# EAGLE schematic 1 (EAGLE 6.4)
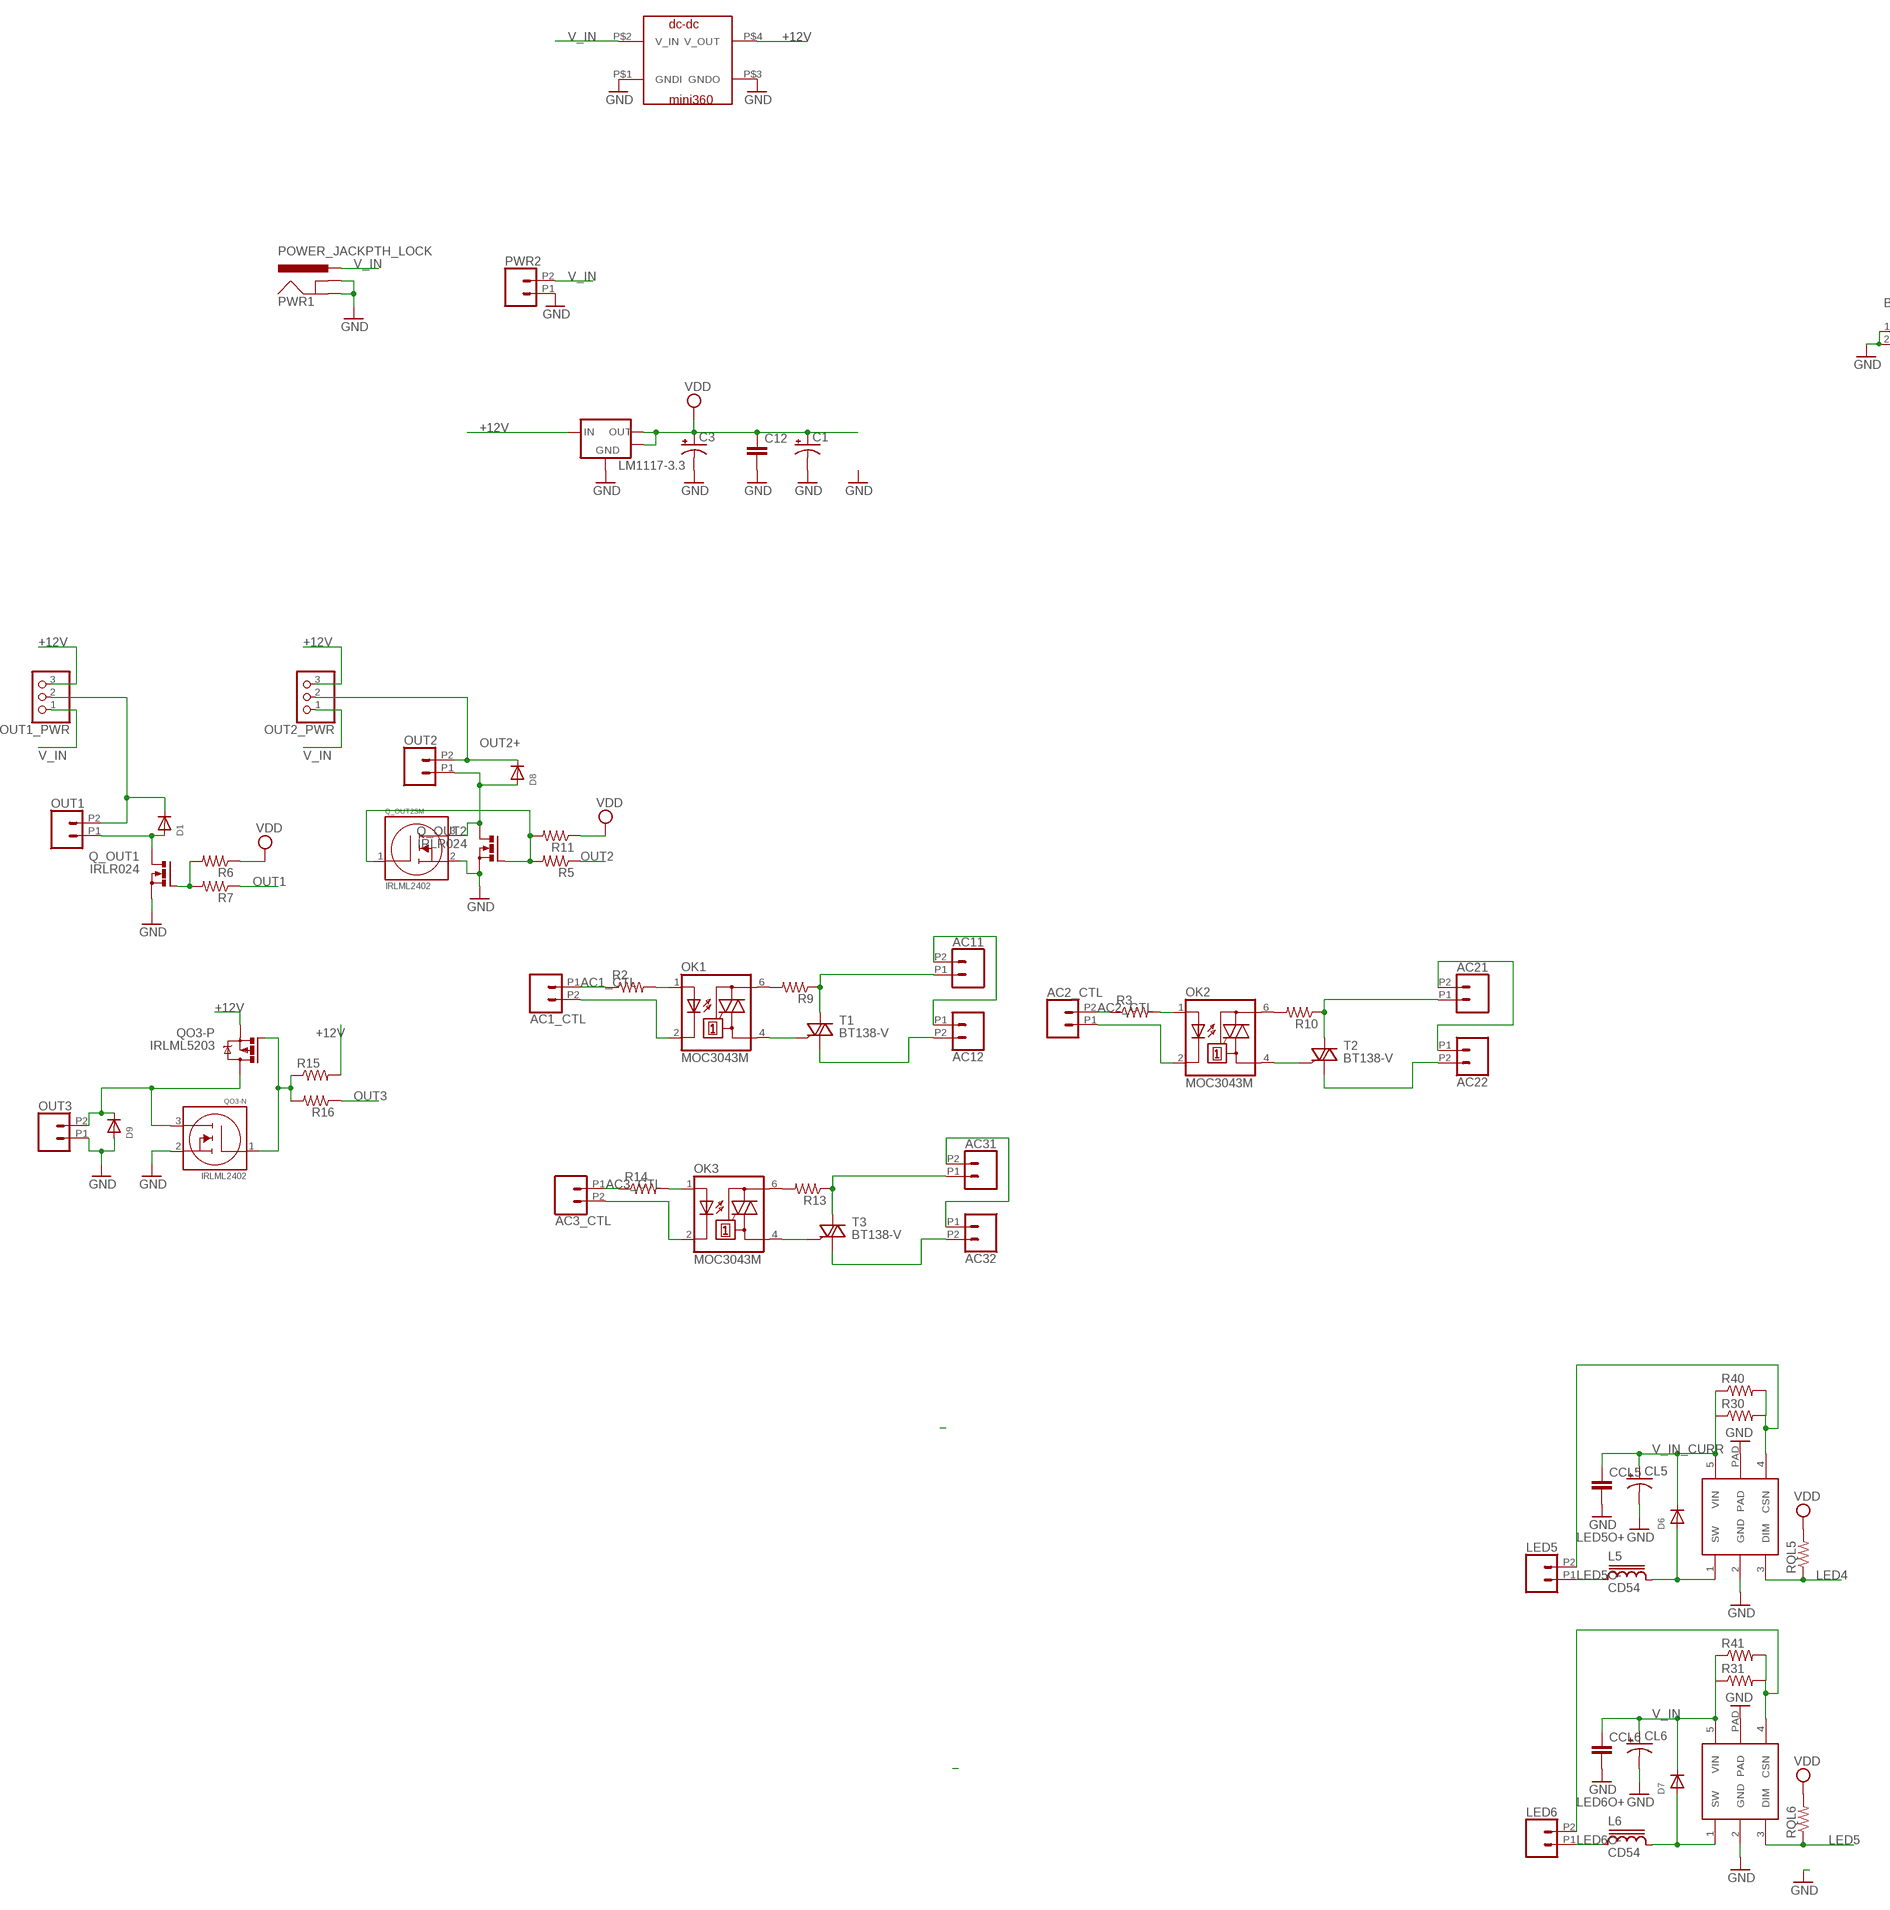
[diagram p0: schematic, sheet 1, part 1 of 3]
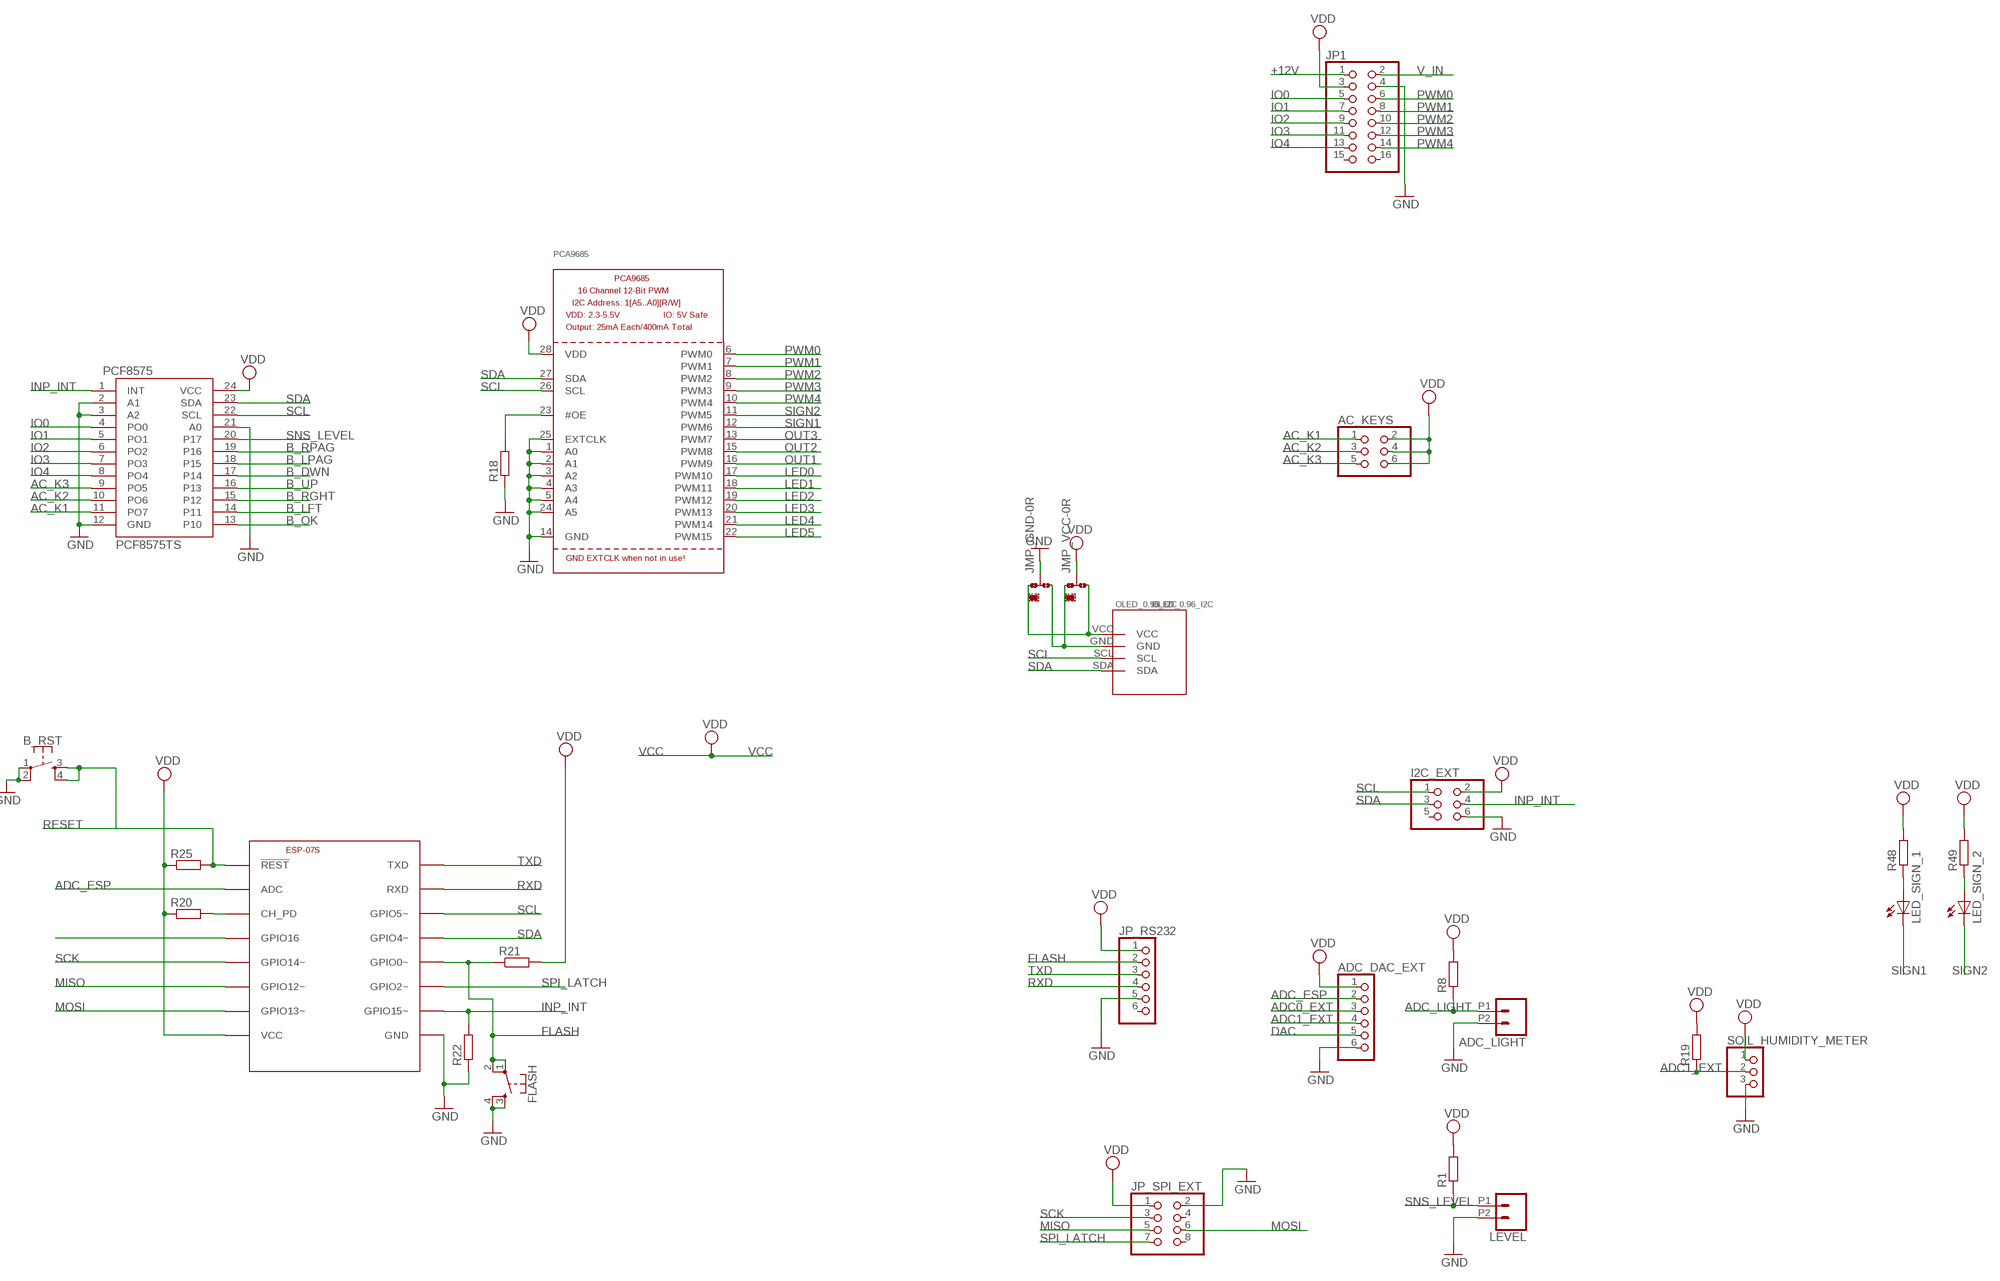
[diagram p1: schematic, sheet 1, part 2 of 3]
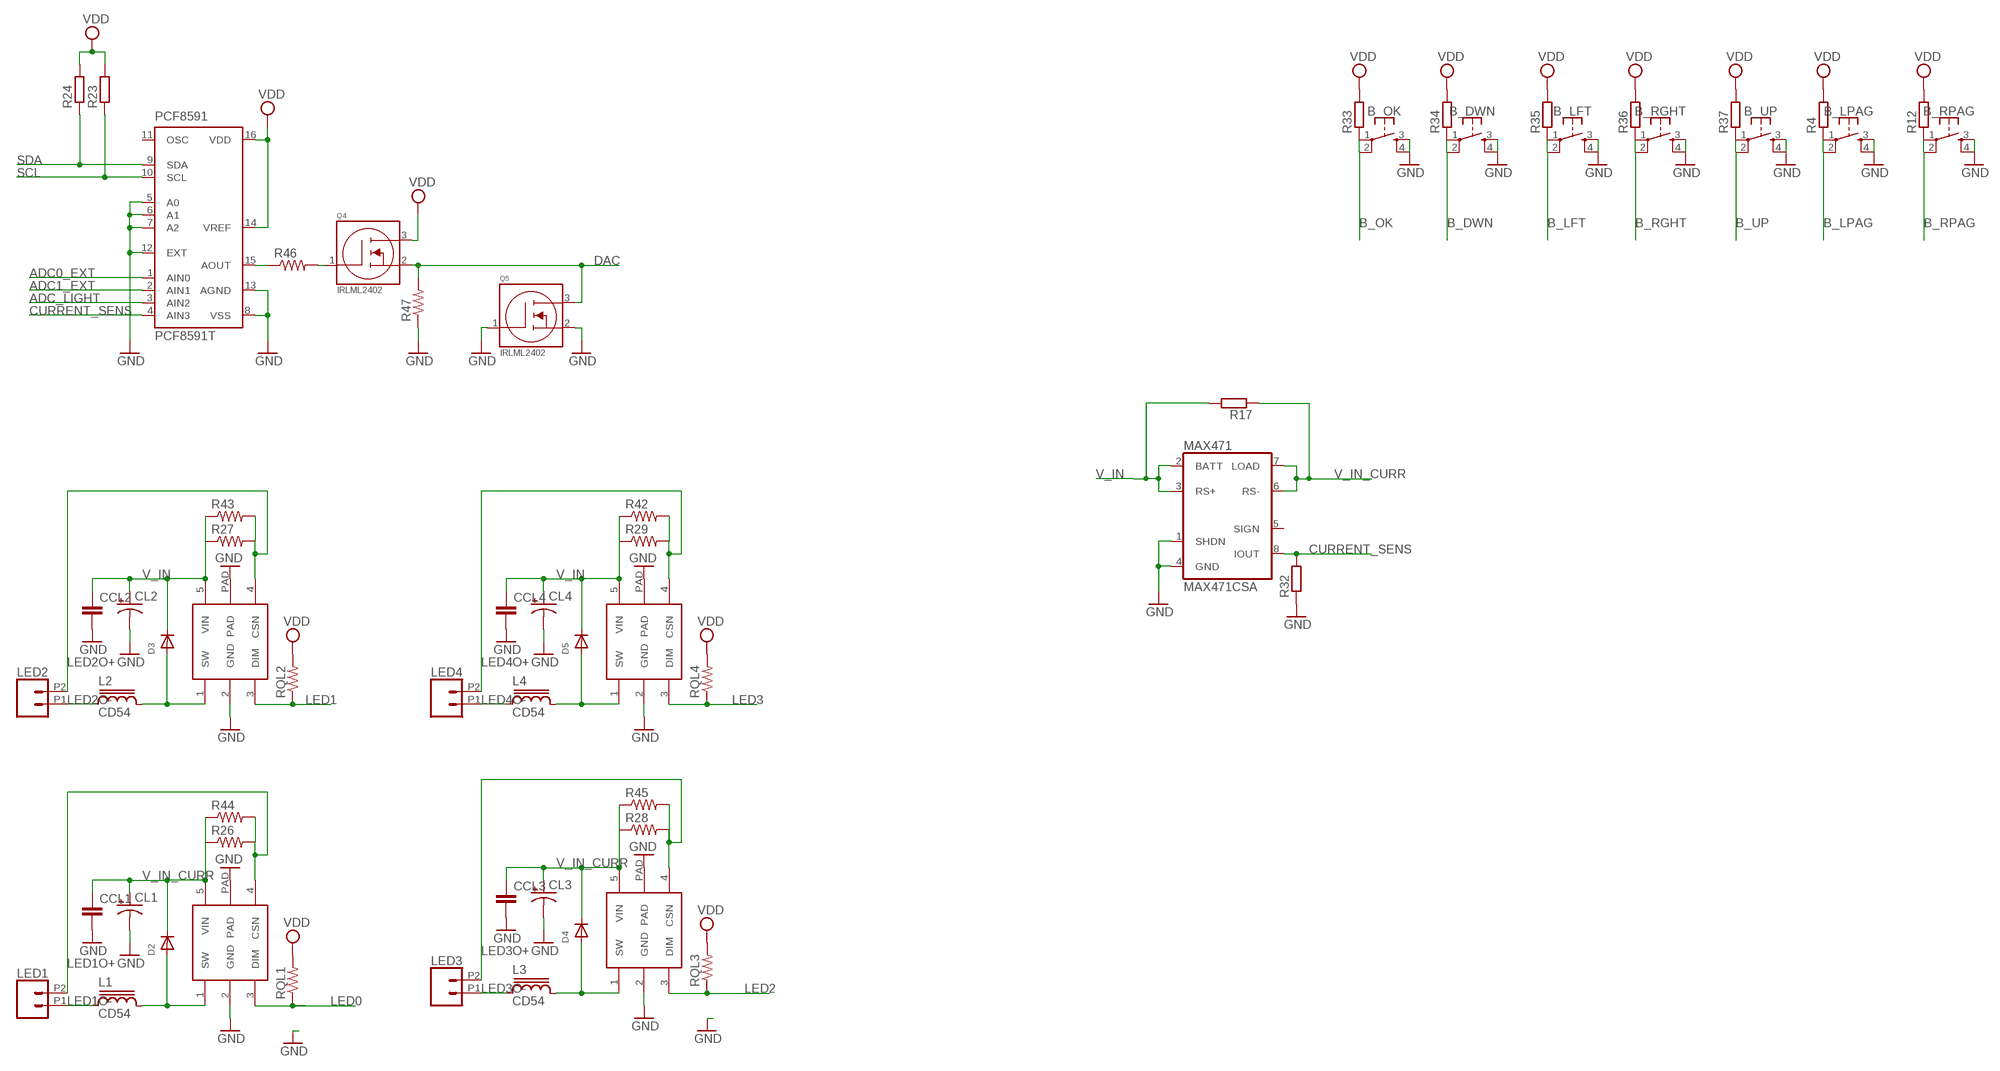
[diagram p2: schematic, sheet 1, part 3 of 3]

## Parts
AC1_CTL  CONN_022.54MM_SCREWTERM  [1X02_2.54_SCREWTERM]
AC2_CTL  CONN_022.54MM_SCREWTERM  [1X02_2.54_SCREWTERM]
AC3_CTL  CONN_022.54MM_SCREWTERM  [1X02_2.54_SCREWTERM]
AC11  CONN_022.54MM_SCREWTERM  [1X02_2.54_SCREWTERM]
AC12  CONN_022.54MM_SCREWTERM  [1X02_2.54_SCREWTERM]
AC21  CONN_022.54MM_SCREWTERM  [1X02_2.54_SCREWTERM]
AC22  CONN_022.54MM_SCREWTERM  [1X02_2.54_SCREWTERM]
AC31  CONN_022.54MM_SCREWTERM  [1X02_2.54_SCREWTERM]
AC32  CONN_022.54MM_SCREWTERM  [1X02_2.54_SCREWTERM]
AC_KEYS  PINHD-2X3  [2X03]
ADC_DAC_EXT  PINHD-1X6  [1X06]
ADC_LIGHT  CONN_022.54MM_SCREWTERM  [1X02_2.54_SCREWTERM]
B_DWN  MOMENTARY-SWITCH-SPST-2-SMD-5.2MM  [TACTILE_SWITCH_SMD_5.2MM]
B_LFT  MOMENTARY-SWITCH-SPST-2-SMD-5.2MM  [TACTILE_SWITCH_SMD_5.2MM]
B_LPAG  MOMENTARY-SWITCH-SPST-2-SMD-5.2MM  [TACTILE_SWITCH_SMD_5.2MM]
B_OK  MOMENTARY-SWITCH-SPST-2-SMD-5.2MM  [TACTILE_SWITCH_SMD_5.2MM]
B_RGHT  MOMENTARY-SWITCH-SPST-2-SMD-5.2MM  [TACTILE_SWITCH_SMD_5.2MM]
B_RPAG  MOMENTARY-SWITCH-SPST-2-SMD-5.2MM  [TACTILE_SWITCH_SMD_5.2MM]
B_RST  MOMENTARY-SWITCH-SPST-2-SMD-5.2MM  [TACTILE_SWITCH_SMD_5.2MM]
B_UP  MOMENTARY-SWITCH-SPST-2-SMD-5.2MM  [TACTILE_SWITCH_SMD_5.2MM]
C1  CPOL-US153CLV-0505  [153CLV-0505]
C3  CPOL-US153CLV-0505  [153CLV-0505]
C12  C-EUC0805  [C0805]
CCL1  C-EUC0805K  [C0805K]
CCL2  C-EUC0805K  [C0805K]
CCL3  C-EUC0805K  [C0805K]
CCL4  C-EUC0805K  [C0805K]
CCL5  C-EUC0805K  [C0805K]
CCL6  C-EUC0805K  [C0805K]
CL1  CPOL-US153CLV-0605  [153CLV-0605]
CL2  CPOL-US153CLV-0605  [153CLV-0605]
CL3  CPOL-US153CLV-0605  [153CLV-0605]
CL4  CPOL-US153CLV-0605  [153CLV-0605]
CL5  CPOL-US153CLV-0605  [153CLV-0605]
CL6  CPOL-US153CLV-0605  [153CLV-0605]
D1  DIODESMA  [SMADIODE]
D2  DIODESMA  [SMADIODE]
D3  DIODESMA  [SMADIODE]
D4  DIODESMA  [SMADIODE]
D5  DIODESMA  [SMADIODE]
D6  DIODESMA  [SMADIODE]
D7  DIODESMA  [SMADIODE]
D8  DIODESMA  [SMADIODE]
D9  DIODESMA  [SMADIODE]
ESP-07S  ESP8266-08  [ESP-08]
FLASH  MOMENTARY-SWITCH-SPST-2-SMD-5.2MM  [TACTILE_SWITCH_SMD_5.2MM]
I2C_EXT  PINHD-2X3  [2X03]
JMP_GND  0R-JUMPA  [A0R-JMP]
JMP_VCC  0R-JUMPA  [A0R-JMP]
JP1  PINHD-2X8  [2X08]
JP_RS232  PINHD-1X6  [1X06]
JP_SPI_EXT  PINHD-2X4  [2X04]
L1  CD54  [CD54]
L2  CD54  [CD54]
L3  CD54  [CD54]
L4  CD54  [CD54]
L5  CD54  [CD54]
L6  CD54  [CD54]
LED1  CONN_022.54MM_SCREWTERM  [1X02_2.54_SCREWTERM]
LED2  CONN_022.54MM_SCREWTERM  [1X02_2.54_SCREWTERM]
LED3  CONN_022.54MM_SCREWTERM  [1X02_2.54_SCREWTERM]
LED4  CONN_022.54MM_SCREWTERM  [1X02_2.54_SCREWTERM]
LED5  CONN_022.54MM_SCREWTERM  [1X02_2.54_SCREWTERM]
LED6  CONN_022.54MM_SCREWTERM  [1X02_2.54_SCREWTERM]
LED_SIGN_1  LEDCHIP-LED0805  [CHIP-LED0805]
LED_SIGN_2  LEDCHIP-LED0805  [CHIP-LED0805]
LEVEL  CONN_022.54MM_SCREWTERM  [1X02_2.54_SCREWTERM]
LM1117-3.3  LM1117-3.3  [SOT223]
MAX471  MAX471CSA  [SO08]
OK1  MOC3043M  [DIL06]
OK2  MOC3043M  [DIL06]
OK3  MOC3043M  [DIL06]
OLED_0.96_I2C  OLED_0.96_I2C  [OLED_0.96_I2C]
OUT1  CONN_022.54MM_SCREWTERM  [1X02_2.54_SCREWTERM]
OUT1_PWR  PINHD-1X3  [1X03]
OUT2  CONN_022.54MM_SCREWTERM  [1X02_2.54_SCREWTERM]
OUT2_PWR  PINHD-1X3  [1X03]
OUT3  CONN_022.54MM_SCREWTERM  [1X02_2.54_SCREWTERM]
PCA9685  PCA9685  [TSSOP28]
PCF8575  PCF8575TS  [SSOP24]
PCF8591  PCF8591T  [SO16W]
PWR1  POWER_JACKPTH_LOCK  [POWER_JACK_PTH_LOCK]
PWR2  CONN_022.54MM_SCREWTERM  [1X02_2.54_SCREWTERM]
Q4  IRLML2402  [SOT23]
Q5  IRLML2402  [SOT23]
Q_OUT1  IRLR024  [D-PAK_TO252AA]
Q_OUT2  IRLR024  [D-PAK_TO252AA]
Q_OUT2SM  IRLML2402  [SOT23]
QO3-N  IRLML2402  [SOT23]
QO3-P  IRLML5203  [MICRO3]
R1  R-EU_M0805  [M0805]
R2  RESISTOR0805-RES  [0805]
R3  RESISTOR0805-RES  [0805]
R4  R-EU_M0805  [M0805]
R5  RESISTOR0805-RES  [0805]
R6  RESISTOR0805-RES  [0805]
R7  RESISTOR0805-RES  [0805]
R8  R-EU_M0805  [M0805]
R9  RESISTOR0805-RES  [0805]
R10  RESISTOR0805-RES  [0805]
R11  RESISTOR0805-RES  [0805]
R12  R-EU_M0805  [M0805]
R13  RESISTOR0805-RES  [0805]
R14  RESISTOR0805-RES  [0805]
R15  RESISTOR0805-RES  [0805]
R16  RESISTOR0805-RES  [0805]
R17  R-EU_M0805  [M0805]
R18  R-EU_M0805  [M0805]
R19  R-EU_M0805  [M0805]
R20  R-EU_M0805  [M0805]
R21  R-EU_M0805  [M0805]
R22  R-EU_M0805  [M0805]
R23  R-EU_M0805  [M0805]
R24  R-EU_M0805  [M0805]
R25  R-EU_M0805  [M0805]
R26  RESISTOR  [0805]
R27  RESISTOR  [0805]
R28  RESISTOR  [0805]
R29  RESISTOR  [0805]
R30  RESISTOR  [0805]
R31  RESISTOR  [0805]
R32  R-EU_M0805  [M0805]
R33  R-EU_M0805  [M0805]
R34  R-EU_M0805  [M0805]
R35  R-EU_M0805  [M0805]
R36  R-EU_M0805  [M0805]
R37  R-EU_M0805  [M0805]
R40  RESISTOR  [0805]
R41  RESISTOR  [0805]
R42  RESISTOR  [0805]
R43  RESISTOR  [0805]
R44  RESISTOR  [0805]
R45  RESISTOR  [0805]
R46  RESISTOR  [0805]
R47  RESISTOR  [0805]
R48  R-EU_M0805  [M0805]
R49  R-EU_M0805  [M0805]
RQL1  RESISTOR  [0805]
RQL2  RESISTOR  [0805]
RQL3  RESISTOR  [0805]
RQL4  RESISTOR  [0805]
RQL5  RESISTOR  [0805]
RQL6  RESISTOR  [0805]
SOIL_HUMIDITY_METER  PINHD-1X3  [1X03]
T1  BT138-V  [TO220BV]
T2  BT138-V  [TO220BV]
T3  BT138-V  [TO220BV]
U$6  PT4115  [SOT89-5]
U$7  PT4115  [SOT89-5]
U$8  PT4115  [SOT89-5]
U$9  PT4115  [SOT89-5]
U$10  PT4115  [SOT89-5]
U$12  MINI360  [MINI360]
U$13  PT4115  [SOT89-5]

## Nets
+12V: JP1.1 LM1117-3.3.3(IN) OUT1_PWR.3 OUT2_PWR.3 QO3-P.2(S) R15.2 U$12.P$4(V_OUT)
AC1_CTL: AC1_CTL.P1 R2.1
AC2_CTL: AC2_CTL.P2 R3.1
AC3_CTL: AC3_CTL.P1 R14.1
AC11: AC11.P1 R9.1 T1.T2(A2)
AC12: AC12.P2 T1.T1(A1)
AC13: AC11.P2 AC12.P1
AC21: AC21.P1 R10.1 T2.T2(A2)
AC22: AC22.P2 T2.T1(A1)
AC23: AC21.P2 AC22.P1
AC31: AC31.P1 R13.1 T3.T2(A2)
AC32: AC32.P2 T3.T1(A1)
AC33: AC31.P2 AC32.P1
AC_K1: AC_KEYS.1 PCF8575.11(PO7)
AC_K2: AC_KEYS.3 PCF8575.10(PO6)
AC_K3: AC_KEYS.5 PCF8575.9(PO5)
ADC0_EXT: ADC_DAC_EXT.3 PCF8591.1(AIN0)
ADC1_EXT: ADC_DAC_EXT.4 PCF8591.2(AIN1) R19.1 SOIL_HUMIDITY_METER.2
ADC_ESP: ADC_DAC_EXT.2 ESP-07S.ADC
ADC_LIGHT: ADC_LIGHT.P1 PCF8591.3(AIN2) R8.1
B_DWN: B_DWN.1 B_DWN.2 PCF8575.17(P14) R34.1
B_LFT: B_LFT.1 B_LFT.2 PCF8575.14(P11) R35.1
B_LPAG: B_LPAG.1 B_LPAG.2 PCF8575.18(P15) R4.1
B_OK: B_OK.1 B_OK.2 PCF8575.13(P10) R33.1
B_RGHT: B_RGHT.1 B_RGHT.2 PCF8575.15(P12) R36.1
B_RPAG: B_RPAG.1 B_RPAG.2 PCF8575.19(P16) R12.1
B_UP: B_UP.1 B_UP.2 PCF8575.16(P13) R37.1
CURRENT_SENS: MAX471.8(IOUT) PCF8591.4(AIN3) R32.2
DAC: ADC_DAC_EXT.5 Q4.2(SOURCE) Q5.3(DRAIN) R47.2
FLASH: ESP-07S.GPIO0(GPIO0~) FLASH.1 FLASH.2 JP_RS232.2 R21.1
GND: ADC_DAC_EXT.6 ADC_LIGHT.P2 B_DWN.3 B_DWN.4 B_LFT.3 B_LFT.4 B_LPAG.3 B_LPAG.4 B_OK.3 B_OK.4 B_RGHT.3 B_RGHT.4 B_RPAG.3 B_RPAG.4 B_RST.1 B_RST.2 B_UP.3 B_UP.4 C1.- C3.- C12.2 CCL1.2 CCL2.2 CCL3.2 CCL4.2 CCL5.2 CCL6.2 CL1.- CL2.- CL3.- CL4.- CL5.- CL6.- D9.A ESP-07S.GND FLASH.3 FLASH.4 I2C_EXT.6 JMP_GND.2 JP1.4 JP_RS232.5 JP_SPI_EXT.2 LEVEL.P2 LM1117-3.3.1(GND) MAX471.1(SHDN) MAX471.4(GND) OUT3.P1 PCA9685.1(A0) PCA9685.2(A1) PCA9685.3(A2) PCA9685.4(A3) PCA9685.5(A4) PCA9685.14(GND) PCA9685.24(A5) PCA9685.25(EXTCLK) PCF8575.2(A1) PCF8575.3(A2) PCF8575.12(GND) PCF8575.21(A0) PCF8591.5(A0) PCF8591.6(A1) PCF8591.7(A2) PCF8591.8(VSS) PCF8591.12(EXT) PCF8591.13(AGND) PWR1.GND PWR1.GNDBREAK PWR2.P1 Q5.1(GATE) Q5.2(SOURCE) Q_OUT1.3(SOURCE) Q_OUT2.3(SOURCE) Q_OUT2SM.2(SOURCE) QO3-N.2(SOURCE) R18.1 R22.1 R32.1 R47.1 SOIL_HUMIDITY_METER.3 U$6.2(GND) U$6.PAD U$7.2(GND) U$7.PAD U$8.2(GND) U$8.PAD U$9.2(GND) U$9.PAD U$10.2(GND) U$10.PAD U$12.P$1(GNDI) U$12.P$3(GNDO) U$13.2(GND) U$13.PAD
INP_INT: ESP-07S.GPIO15(GPIO15~) I2C_EXT.4 PCF8575.1(INT) R22.2
IO0: JP1.5 PCF8575.4(PO0)
IO1: JP1.7 PCF8575.5(PO1)
IO2: JP1.9 PCF8575.6(PO2)
IO3: JP1.11 PCF8575.7(PO3)
IO4: JP1.13 PCF8575.8(PO4)
LED0: PCA9685.17(PWM10) RQL1.1 U$13.3(DIM)
LED1: PCA9685.18(PWM11) RQL2.1 U$6.3(DIM)
LED1_SW: D2.A L1.2 U$13.1(SW)
LED1O+: LED1.P2 R26.2 R44.2 U$13.4(CSN)
LED1O-: L1.1 LED1.P1
LED2: PCA9685.19(PWM12) RQL3.1 U$7.3(DIM)
LED2_SW: D3.A L2.2 U$6.1(SW)
LED2O+: LED2.P2 R27.2 R43.2 U$6.4(CSN)
LED2O-: L2.1 LED2.P1
LED3: PCA9685.20(PWM13) RQL4.1 U$8.3(DIM)
LED3_SW: D4.A L3.2 U$7.1(SW)
LED3O+: LED3.P2 R28.2 R45.2 U$7.4(CSN)
LED3O-: L3.1 LED3.P1
LED4: PCA9685.21(PWM14) RQL5.1 U$9.3(DIM)
LED4_SW: D5.A L4.2 U$8.1(SW)
LED4O+: LED4.P2 R29.2 R42.2 U$8.4(CSN)
LED4O-: L4.1 LED4.P1
LED5: PCA9685.22(PWM15) RQL6.1 U$10.3(DIM)
LED5_SW: D6.A L5.2 U$9.1(SW)
LED5O+: LED5.P2 R30.2 R40.2 U$9.4(CSN)
LED5O-: L5.1 LED5.P1
LED6_SW: D7.A L6.2 U$10.1(SW)
LED6O+: LED6.P2 R31.2 R41.2 U$10.4(CSN)
LED6O-: L6.1 LED6.P1
MISO: ESP-07S.GPIO12(GPIO12~) JP_SPI_EXT.5
MOSI: ESP-07S.GPIO13(GPIO13~) JP_SPI_EXT.6
N$1: JMP_GND.1 JMP_VCC.3 OLED_0.96_I2C.VCC
N$3: JMP_GND.3 JMP_VCC.1 OLED_0.96_I2C.GND
N$4: LED_SIGN_1.A R48.1
N$5: LED_SIGN_2.A R49.1
N$6: AC1_CTL.P2 OK1.2(C)
N$8: PCA9685.23(#OE) R18.2
N$9: Q_OUT2.1(GATE) Q_OUT2SM.1(GATE) R5.2 R11.2
N$11: Q_OUT1.1(GATE) R6.2 R7.2
N$13: QO3-N.1(GATE) QO3-P.1(G) R15.1 R16.2
N$16: AC3_CTL.P2 OK3.2(C)
N$18: OK1.1(A) R2.2
N$19: OK1.4(A1) T1.G
N$20: ESP-07S.CH_PD R20.2
N$24: OK1.6(A2) R9.2
N$28: OK2.4(A1) T2.G
N$31: OK2.6(A2) R10.2
N$32: OK2.1(A) R3.2
N$34: OK3.4(A1) T3.G
N$35: OK3.6(A2) R13.2
N$36: PCF8591.15(AOUT) R46.1
N$37: ESP-07S.GPIO16
N$42: Q4.1(GATE) R46.2
N$45: AC2_CTL.P1 OK2.2(C)
N$47: OK3.1(A) R14.2
OUT1: PCA9685.16(PWM9) R7.1
OUT1+: D1.C OUT1.P2 OUT1_PWR.2
OUT1-: D1.A OUT1.P1 Q_OUT1.2(DRAIN)
OUT2: PCA9685.15(PWM8) R5.1
OUT2+: D8.C OUT2.P2 OUT2_PWR.2
OUT2-: D8.A OUT2.P1 Q_OUT2.2(DRAIN) Q_OUT2SM.3(DRAIN)
OUT3: PCA9685.13(PWM7) R16.1
OUT3+: D9.C OUT3.P2 QO3-N.3(DRAIN) QO3-P.3(D)
PWM0: JP1.6 PCA9685.6(PWM0)
PWM1: JP1.8 PCA9685.7(PWM1)
PWM2: JP1.10 PCA9685.8(PWM2)
PWM3: JP1.12 PCA9685.9(PWM3)
PWM4: JP1.14 PCA9685.10(PWM4)
RESET: B_RST.3 B_RST.4 ESP-07S.REST(!REST) R25.2
RXD: ESP-07S.RXD JP_RS232.4
SCK: ESP-07S.GPIO14(GPIO14~) JP_SPI_EXT.3
SCL: ESP-07S.GPIO4(GPIO5~) I2C_EXT.1 OLED_0.96_I2C.SCL PCA9685.26(SCL) PCF8575.22(SCL) PCF8591.10(SCL) R23.1
SDA: ESP-07S.GPIO5(GPIO4~) I2C_EXT.3 OLED_0.96_I2C.SDA PCA9685.27(SDA) PCF8575.23(SDA) PCF8591.9(SDA) R24.1
SIGN1: LED_SIGN_1.C PCA9685.12(PWM6)
SIGN2: LED_SIGN_2.C PCA9685.11(PWM5)
SNS_LEVEL: LEVEL.P1 PCF8575.20(P17) R1.1
SPI_LATCH: ESP-07S.GPIO2(GPIO2~) JP_SPI_EXT.7
TXD: ESP-07S.TXD JP_RS232.3
V_IN: CCL2.1 CCL4.1 CCL6.1 CL2.+ CL4.+ CL6.+ D3.C D5.C D7.C JP1.2 MAX471.2(BATT) MAX471.3(RS+) OUT1_PWR.1 OUT2_PWR.1 PWR1.PWR PWR2.P2 R17.2 R27.1 R29.1 R31.1 R41.1 R42.1 R43.1 U$6.5(VIN) U$8.5(VIN) U$10.5(VIN) U$12.P$2(V_IN)
V_IN_CURR: CCL1.1 CCL3.1 CCL5.1 CL1.+ CL3.+ CL5.+ D2.C D4.C D6.C MAX471.6(RS-) MAX471.7(LOAD) R17.1 R26.1 R28.1 R30.1 R40.1 R44.1 R45.1 U$7.5(VIN) U$9.5(VIN) U$13.5(VIN)
VDD: AC_KEYS.2 AC_KEYS.4 AC_KEYS.6 ADC_DAC_EXT.1 C1.+ C3.+ C12.1 ESP-07S.VCC I2C_EXT.2 JMP_VCC.2 JP1.3 JP_RS232.1 JP_SPI_EXT.1 LM1117-3.3.2(OUT) LM1117-3.3.4(MASS) PCA9685.28(VDD) PCF8575.24(VCC) PCF8591.14(VREF) PCF8591.16(VDD) Q4.3(DRAIN) R1.2 R4.2 R6.1 R8.2 R11.1 R12.2 R19.2 R20.1 R21.2 R23.2 R24.2 R25.1 R33.2 R34.2 R35.2 R36.2 R37.2 R48.2 R49.2 RQL1.2 RQL2.2 RQL3.2 RQL4.2 RQL5.2 RQL6.2 SOIL_HUMIDITY_METER.1
Unconnected: I2C_EXT.5 JP1.15 JP1.16 JP_RS232.6 JP_SPI_EXT.4 JP_SPI_EXT.8 MAX471.5(SIGN) PCF8591.11(OSC)

## Library data of the parts
AC1_CTL AC2_CTL AC3_CTL AC11 AC12 AC21 AC22 AC31 AC32 = SparkFun-Retired:CONN_02: Multi connection point. Often used as Generic Header-pin footprint for 0.1 inch spaced/style header connections On any of the 0.1 inch spaced packages, you can populate with these: Break Away Headers - Straight <https://www.sparkfun.com/products/116> (PRT-00116) Break Away Male Headers - Right Angle <https://www.sparkfun.com/products/553> (PRT-00553) Female Headers <https://www.sparkfun.com/products/115> (PRT-00115) Break Away Headers - Machine Pin <https://www.sparkfun.com/products/117> (PRT-00117) Break Away Female Headers - Swiss Machine Pin <https://www.sparkfun.com/products/743> (PRT-00743) For SCREWTERMINALS and SPRING TERMINALS visit here: Screw Terimnals on SparkFun.com <https://www.sparkfun.com/search/results?term=Screw+Terminals> (5mm/3.5mm/2.54mm spacing) This device is also useful as a general connection point to wire up your design to another part of your project. Our various solder wires solder well into these plated through hole pads. Hook-Up Wire - Assortment (Stranded, 22 AWG) <https://www.sparkfun.com/products/11375> (PRT-11375) Hook-Up Wire - Assortment (Solid Core, 22 AWG) <https://www.sparkfun.com/products/11367> (PRT-11367) View the entire wire category on our website here <https://www.sparkfun.com/categories/141> Special notes: Molex polarized connector foot print use with: PRT-08233 with associated crimp pins and housings. 2.54_SCREWTERM for use with PRT-10571. 3.5mm Screw Terminal footprints for PRT-08084 5mm Screw Terminal footprints for use with PRT-08432
AC_KEYS I2C_EXT = pinhead:PINHD-2X3: PIN HEADER
ADC_DAC_EXT JP_RS232 = pinhead:PINHD-1X6: PIN HEADER
ADC_LIGHT LED1-LED6 LEVEL OUT1-OUT3 PWR2 = SparkFun-Connectors:CONN_02: Multi connection point. Often used as Generic Header-pin footprint for 0.1 inch spaced/style header connections On any of the 0.1 inch spaced packages, you can populate with these: Break Away Headers - Straight <https://www.sparkfun.com/products/116> (PRT-00116) Break Away Male Headers - Right Angle <https://www.sparkfun.com/products/553> (PRT-00553) Female Headers <https://www.sparkfun.com/products/115> (PRT-00115) Break Away Headers - Machine Pin <https://www.sparkfun.com/products/117> (PRT-00117) Break Away Female Headers - Swiss Machine Pin <https://www.sparkfun.com/products/743> (PRT-00743) For SCREWTERMINALS and SPRING TERMINALS visit here: Screw Terimnals on SparkFun.com <https://www.sparkfun.com/search/results?term=Screw+Terminals> (5mm/3.5mm/2.54mm spacing) This device is also useful as a general connection point to wire up your design to another part of your project. Our various solder wires solder well into these plated through hole pads. Hook-Up Wire - Assortment (Stranded, 22 AWG) <https://www.sparkfun.com/products/11375> (PRT-11375) Hook-Up Wire - Assortment (Solid Core, 22 AWG) <https://www.sparkfun.com/products/11367> (PRT-11367) View the entire wire category on our website here <https://www.sparkfun.com/categories/141> Special notes: Molex polarized connector foot print use with: PRT-08233 with associated crimp pins and housings. 2.54_SCREWTERM for use with PRT-10571. 3.5mm Screw Terminal footprints for PRT-08084 5mm Screw Terminal footprints for use with PRT-08432
B_DWN B_LFT B_LPAG B_OK B_RGHT B_RPAG B_RST B_UP FLASH = SparkFun-Switches:MOMENTARY-SWITCH-SPST-2: Momentary Switch (Pushbutton) - SPST - Two Circuits Normally-open (NO) SPST momentary switches (buttons, pushbuttons). Schematic symbol includes two switch circuits. Variants SMD-4.6MMX2.8MM - 4.60mm x 2.80mm Tactile Momentary Button Switch - Used on SparkFun SAMD21 Mini Breakout <https://www.sparkfun.com/products/13664> SMD-5.2MM - Mini Pushbutton Switch - SMD <https://www.sparkfun.com/products/8720> - Used on Arduino Pro Mini <https://www.sparkfun.com/products/11114>; PROD_ID: SWCH-08247; SF_SKU: COM-08720
C1 C3 CL1-CL6 = adafruit:CPOL-US: POLARIZED CAPACITOR, American symbol
C12 CCL1-CCL6 = rcl:C-EU: CAPACITOR, European symbol
D1-D9 = adafruit:DIODE: Diode SMADIODE - SMA Surface Mount Package 20V 1A Schottky Diode Digikey: 641-1014-6-ND DO-1N4148 - Through Hole Small Current Diode SOD-123 20V 1 A (.5mV Vf) Schottky Diode - Digikey: MBRX120TPMSCT-ND SOD-323 10V 570mA (.38mV Vf, 3ns) Schottky Diode - Digikey: ZLLS410CT-ND SOD-523 30V 30mA Schottky Diode (RB751S-40TE61) - Digikey: RB751S-40TE61CT-ND SOT23-R/W - SOT23 Package (R = Solder Paste/Reflow Ovens, W = Hand-Soldering) BAT54Film 40V 300mA - Digikey: 497-7162-1-ND
ESP-07S = lio:ESP8266
JMP_GND JMP_VCC = jump-0r-smd:0R-JUMP: SMD 0R 0805 Jumper
JP1 = pinhead:PINHD-2X8: PIN HEADER
JP_SPI_EXT = pinhead:PINHD-2X4: PIN HEADER
L1-L6 = inductor-sumida:CD54: POWER INDUCTOR
LED_SIGN_1 LED_SIGN_2 = adafruit:LED: LED OSRAM: - CHIPLED LG R971, LG N971, LY N971, LG Q971, LY Q971, LO R971, LY R971 LH N974, LH R974 LS Q976, LO Q976, LY Q976 LO Q996 - Hyper CHIPLED LW Q18S LB Q993, LB Q99A, LB R99A - SideLED LS A670, LO A670, LY A670, LG A670, LP A670 LB A673, LV A673, LT A673, LW A673 LH A674 LY A675 LS A676, LA A676, LO A676, LY A676, LW A676 LS A679, LY A679, LG A679 - Hyper Micro SIDELED® LS Y876, LA Y876, LO Y876, LY Y876 LT Y87S - SmartLED LW L88C, LW L88S LB L89C, LB L89S, LG L890 LS L89K, LO L89K, LY L89K LS L896, LA L896, LO L896, LY L896 - TOPLED LS T670, LO T670, LY T670, LG T670, LP T670 LSG T670, LSP T670, LSY T670, LOP T670, LYG T670 LG T671, LOG T671, LSG T671 LB T673, LV T673, LT T673, LW T673 LH T674 LS T676, LA T676, LO T676, LY T676, LB T676, LH T676, LSB T676, LW T676 LB T67C, LV T67C, LT T67C, LS T67K, LO T67K, LY T67K, LW E67C LS E67B, LA E67B, LO E67B, LY E67B, LB E67C, LV E67C, LT E67C LW T67C LS T679, LY T679, LG T679 LS T770, LO T770, LY T770, LG T770, LP T770 LB T773, LV T773, LT T773, LW T773 LH T774 LS E675, LA E675, LY E675, LS T675 LS T776, LA T776, LO T776, LY T776, LB T776 LHGB T686 LT T68C, LB T68C - Hyper Mini TOPLED® LB M676 - Mini TOPLED Santana® LG M470 LS M47K, LO M47K, LY M47K Source: http://www.osram.convergy.de/
LM1117-3.3 = vreg-linear:LM1117: Linear regulators
MAX471 = maxim:MAX471CSA
OK1-OK3 = optocoupler:MOC30*: 6-Pin DIP Zero-Cross Optoisolators Triac Driver Output (250/400 Volt Peak) Source: http://www.fairchildsemi.com/ds/MO/MOC3043-M.pdf; MF: FAIRCHILD SEMICONDUCTOR; MPN: MOC3043-M; OC_FARNELL: 1021371; OC_NEWARK: 72K8900
OLED_0.96_I2C = tft_1.8_1.44_oled_0.96:OLED_0.96_I2C
OUT1_PWR OUT2_PWR SOIL_HUMIDITY_METER = pinhead:PINHD-1X3: PIN HEADER
PCA9685 = adafruit:PCA9685: PCA9685 - 16 Channel 12-Bit I2C PWM Controller 5.0V tolerant 16 channel, 12-bit I2C PWM controller with 25mA per output (max. 400mA total) Digikey: 568-5931-1-ND
PCF8575 = pcf8575ts:PCF8575TS
PCF8591 = micro-philips:PCF8591: I2C-Bus D/A CONVERTER; MPN: PCF8591T/2,512; OC_FARNELL: 1826767; OC_NEWARK: 70R6911
PWR1 = SparkFun-Connectors:POWER_JACK: Power Jack Connector This is the standard 5.5mm barrel jack for power. The PTH is the most common, proven, reliable, footprint. The Slot footprint only works if the mill layer is transmitted to the PCB fab house so be warned. Here are the connectors we sell at SparkFun: DC Barrel Power Jack/Connector <https://www.sparkfun.com/products/119> (PRT-00119) DC Barrel Power Jack/Connector (SMD) <https://www.sparkfun.com/products/12748> (PRT-12748) DC Barrel Jack Adapter - Breadboard Compatible <https://www.sparkfun.com/products/10811> (PRT-10811) It is used on this SparkFun product (and many, many others): SparkFun RedBoard - Programmed with Arduino <https://www.sparkfun.com/products/12757> (DEV-12757) Also, if you need a mating power supply or connector, please check these out: Wall Adapter Power Supply - 9VDC 650mA <https://www.sparkfun.com/products/298> (TOL-00298) DC Barrel Jack Adapter - Male <https://www.sparkfun.com/products/10287> (PRT-10287); PROD_ID: CONN-08197; SF_ID: PRT-00119
Q4 Q5 Q_OUT2SM QO3-N = work:IRLML2402
Q_OUT1 Q_OUT2 = IRLR024:IRLR024
QO3-P = transistor-power:IRLML5203: HEXFET P-Channel Power MOSFET
R1 R4 R8 R12 R17-R25 R32-R37 R48 R49 = rcl:R-EU_: RESISTOR, European symbol
R2 R3 R5-R7 R9-R11 R13-R16 = SparkFun:RESISTOR: Resistor
R26-R31 R40-R47 RQL1-RQL6 = 1dah:RESISTOR: Resistor
T1-T3 = triac:BT138: TRIAC Source: http://www.semiconductors.philips.com BT138_SERIES_2.pdf
U$6-U$10 U$13 = 1dah:PT4115: Small switching mode constant current PS
U$12 = mini360:MINI360